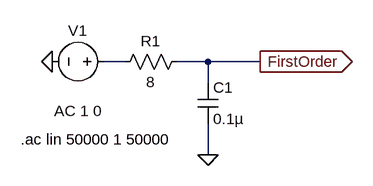
[diagram p0: schematic LowPassRC20kHz.asc]
LowPassRC20kHz.asc, the LTspice schematic file:
Version 4
SHEET 1 880 680
WIRE 64 112 32 112
WIRE 192 112 144 112
WIRE 272 112 192 112
WIRE 192 144 192 112
WIRE 192 256 192 208
FLAG 192 256 0
FLAG -48 112 0
FLAG 272 112 FirstOrder
IOPIN 272 112 Out
SYMBOL voltage 48 112 R90
WINDOW 0 -32 56 VBottom 2
WINDOW 3 32 56 VTop 2
WINDOW 123 60 56 VTop 2
WINDOW 39 0 0 Left 0
SYMATTR InstName V1
SYMATTR Value ""
SYMATTR Value2 AC 1 0
SYMBOL res 160 96 R90
WINDOW 0 0 56 VBottom 2
WINDOW 3 32 56 VTop 2
SYMATTR InstName R1
SYMATTR Value 8
SYMBOL cap 176 144 R0
SYMATTR InstName C1
SYMATTR Value 0.1µ
TEXT -96 232 Left 2 !.ac lin 50000 1 50000

The netlist it stands for:
* LowPassRC20kHz.asc
V1 N001 0 AC 1 0
R1 FirstOrder N001 8
C1 FirstOrder 0 0.1µ
.ac lin 50000 1 50000
.backanno
.end